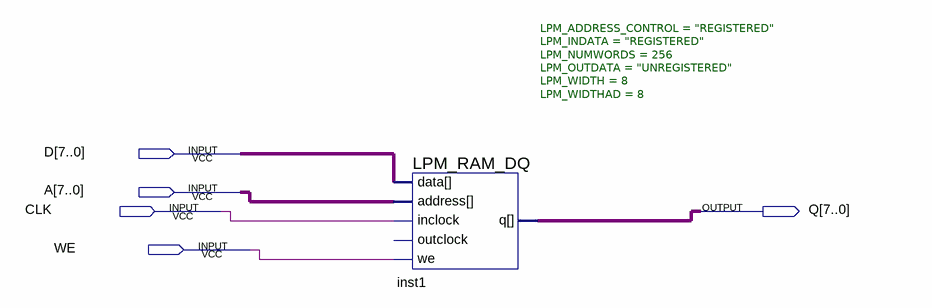
[diagram p0: schematic sheet]
// Quartus schematic ram_dq.bdf as structural Verilog: 1 symbols, 5 pins
module ram_dq (
  input  [7:0] D,
  input  [7:0] A,
  input  CLK,
  input  WE,
  output [7:0] Q
);

  LPM_RAM_DQ #(.LPM_ADDRESS_CONTROL("REGISTERED"), .LPM_INDATA("REGISTERED"), .LPM_NUMWORDS(256), .LPM_OUTDATA("UNREGISTERED"), .LPM_WIDTH(8), .LPM_WIDTHAD(8)) inst1 (
    .inclock(CLK), .data(D), .address(A), .we(WE), .q(Q));  // open: outclock
endmodule
